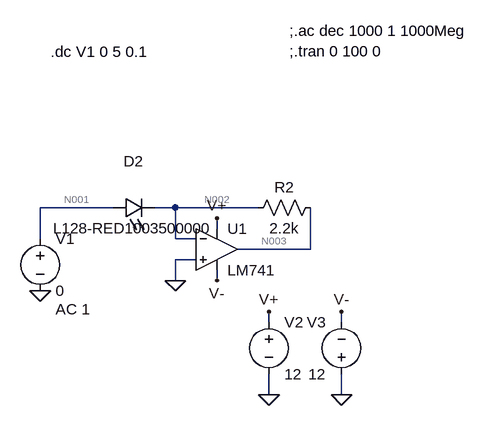
[diagram p0: schematic Derivatore RC.asc]
Derivatore RC.asc, the LTspice schematic file:
Version 4.1
SHEET 1 880 680
WIRE 144 96 32 96
WIRE 240 96 208 96
WIRE 368 96 240 96
WIRE 304 128 304 112
WIRE 32 144 32 96
WIRE 240 144 240 96
WIRE 272 144 240 144
WIRE 448 160 448 96
WIRE 448 160 336 160
WIRE 272 176 240 176
WIRE 240 208 240 176
WIRE 304 208 304 192
WIRE 384 272 384 256
WIRE 496 272 496 256
WIRE 384 384 384 352
WIRE 496 384 496 352
FLAG 240 208 0
FLAG 304 112 V+
FLAG 304 208 V-
FLAG 384 256 V+
FLAG 32 224 0
FLAG 384 384 0
FLAG 496 256 V-
FLAG 496 384 0
SYMBOL OpAmps\\LM741 304 96 R0
SYMATTR InstName U1
SYMBOL voltage 32 128 R0
WINDOW 123 24 124 Left 2
WINDOW 39 0 0 Left 0
SYMATTR Value2 AC 1
SYMATTR InstName V1
SYMATTR Value 0
SYMBOL res 464 80 R90
WINDOW 0 0 56 VBottom 2
WINDOW 3 32 56 VTop 2
SYMATTR InstName R2
SYMATTR Value 2.2k
SYMBOL voltage 384 256 R0
WINDOW 123 0 0 Left 0
WINDOW 39 0 0 Left 0
SYMATTR InstName V2
SYMATTR Value 12
SYMBOL voltage 496 368 R180
WINDOW 0 24 96 Left 2
WINDOW 3 24 16 Left 2
WINDOW 123 0 0 Left 0
WINDOW 39 0 0 Left 0
SYMATTR InstName V3
SYMATTR Value 12
SYMBOL LED 144 112 R270
WINDOW 0 72 32 VTop 2
WINDOW 3 0 32 VBottom 2
SYMATTR InstName D2
SYMATTR Value L128-RED1003500000
TEXT 416 -176 Left 2 !;.ac dec 1000 1 1000Meg\n;.tran 0 100 0
TEXT 48 -144 Left 2 !.dc V1 0 5 0.1

The netlist it stands for:
* Derivatore RC.asc
X§U1 0 N002 V+ V- N003 LM741  ; pins In+ In- V+ V- OUT
V1 N001 0 0 AC 1
R2 N003 N002 2.2k
V2 V+ 0 12
V3 0 V- 12
D2 N001 N002 L128-RED1003500000
.model D D
.lib standard.dio
;.ac dec 1000 1 1000Meg
;.tran 0 100 0
.dc V1 0 5 0.1
.lib LM741.lib
.backanno
.end

* Results of the author's LTspice run, read from the files saved beside the schematic
* Operating Point, zero values left out:
*   V(v+) = 12 V
*   V(n003) = 1.224 mV
*   V(n002) = 1 mV
*   V(v-) = -12 V
*   I(V3) = -1.626 mA
*   I(R2) = 101.9 nA
*   I(V2) = -1.626 mA
*   Ix(u1:1) = 57.86 nA
*   Ix(u1:2) = 101.9 nA
*   Ix(u1:99) = 1.626 mA
*   Ix(u1:50) = -1.626 mA
*   Ix(u1:28) = -101.9 nA
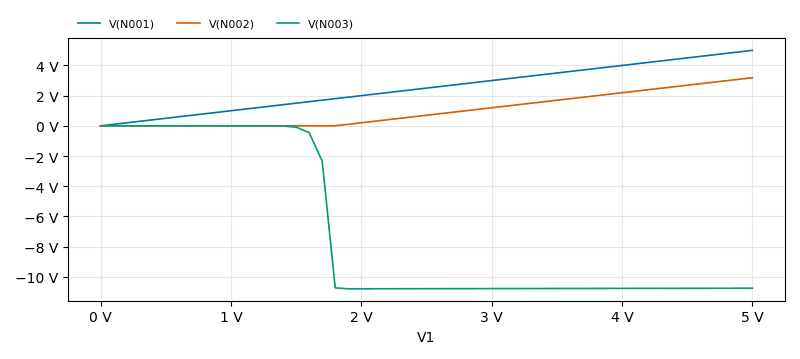
[diagram p1: DC transfer characteristic of Derivatore RC.asc, plotted from the saved traces]
* DC transfer characteristic, 1 run:
*   V(N001): 0 V at V1=0 V, 5 V at V1=5 V, min 0 V, max 5 V
*   V(N002): 1 mV at V1=0 V, 3.187 V at V1=5 V, min 1 mV, max 3.187 V
*   V(N003): 1.224 mV at V1=0 V, -10.76 V at V1=5 V, min -10.8 V, max 1.224 mV